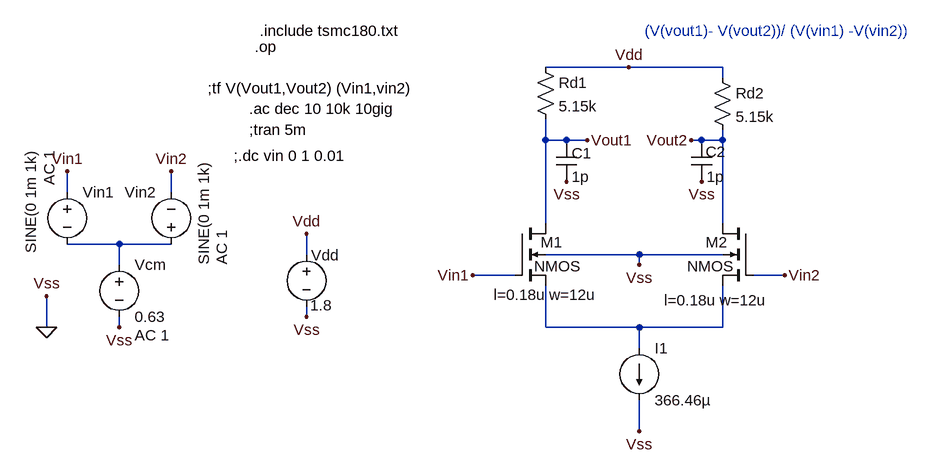
[diagram p0: schematic Differential pair.asc]
Differential pair.asc, the LTspice schematic file:
Version 4
SHEET 1 1248 680
WIRE 752 -64 624 -64
WIRE 896 -64 752 -64
WIRE 896 -48 896 -64
WIRE 624 48 624 16
WIRE 656 48 624 48
WIRE 688 48 656 48
WIRE 864 48 848 48
WIRE 896 48 896 32
WIRE 896 48 864 48
WIRE -112 128 -112 96
WIRE 48 128 48 96
WIRE 624 176 624 48
WIRE 896 176 896 48
WIRE -32 208 -112 208
WIRE 48 208 -32 208
WIRE 256 224 256 192
WIRE 768 224 624 224
WIRE 896 224 768 224
WIRE -32 240 -32 208
WIRE 768 240 768 224
WIRE 576 256 512 256
WIRE 992 256 944 256
WIRE 256 320 256 304
WIRE -144 336 -144 288
WIRE -32 336 -32 320
WIRE 624 336 624 272
WIRE 768 336 624 336
WIRE 896 336 896 272
WIRE 896 336 768 336
WIRE 768 368 768 336
WIRE 768 496 768 448
FLAG -144 336 0
FLAG -144 288 Vss
FLAG 256 320 Vss
FLAG -32 336 Vss
FLAG 256 192 Vdd
FLAG 512 256 Vin1
FLAG 752 -64 Vdd
FLAG 992 256 Vin2
FLAG 768 496 Vss
FLAG 688 48 Vout1
FLAG 848 48 Vout2
FLAG 768 240 Vss
FLAG -112 96 Vin1
FLAG 48 96 Vin2
FLAG 656 112 Vss
FLAG 864 112 Vss
SYMBOL nmos4 576 176 R0
WINDOW 0 40 29 Left 2
WINDOW 3 30 66 Left 2
WINDOW 123 127 110 Right 2
SYMATTR InstName M1
SYMATTR Value2 l=0.18u w=12u
SYMBOL voltage 256 208 R0
WINDOW 123 0 0 Left 0
WINDOW 39 0 0 Left 0
WINDOW 0 7 17 Left 2
WINDOW 3 6 94 Left 2
SYMATTR InstName Vdd
SYMATTR Value 1.8
SYMBOL res 608 -80 R0
SYMATTR InstName Rd1
SYMATTR Value 5.15k
SYMBOL nmos4 944 176 M0
WINDOW 0 40 29 Left 2
WINDOW 3 30 66 Left 2
WINDOW 123 -21 118 Left 2
SYMATTR InstName M2
SYMATTR Value2 l=0.18u w=12u
SYMBOL res 880 -64 R0
SYMATTR InstName Rd2
SYMATTR Value 5.15k
SYMBOL current 768 368 R0
WINDOW 123 0 0 Left 0
WINDOW 39 0 0 Left 0
SYMATTR InstName I1
SYMATTR Value 366.46µ
SYMBOL voltage -32 224 R0
WINDOW 123 24 124 Left 2
WINDOW 39 0 0 Left 0
SYMATTR InstName Vcm
SYMATTR Value 0.63
SYMATTR Value2 AC 1
SYMBOL voltage -112 112 R0
WINDOW 3 -56 -48 VRight 2
WINDOW 123 -28 -48 VRight 2
WINDOW 39 0 0 Left 0
SYMATTR InstName Vin1
SYMATTR Value SINE(0 1m 1k)
SYMATTR Value2 AC 1
SYMBOL voltage 48 224 R180
WINDOW 0 24 96 Left 2
WINDOW 3 -50 -16 VRight 2
WINDOW 123 -78 -16 VRight 2
WINDOW 39 0 0 Left 0
SYMATTR InstName Vin2
SYMATTR Value SINE(0 1m 1k)
SYMATTR Value2 AC 1
SYMBOL cap 640 48 R0
WINDOW 0 24 20 Left 2
SYMATTR InstName C1
SYMATTR Value 1p
SYMBOL cap 848 48 R0
WINDOW 0 22 18 Left 2
SYMATTR InstName C2
SYMATTR Value 1p
TEXT 184 -120 Left 2 !.include tsmc180.txt
TEXT 176 -96 Left 2 !.op
TEXT 104 -32 Left 2 !;tf V(Vout1,Vout2) (Vin1,vin2)
TEXT 168 0 Left 2 !.ac dec 10 10k 10gig
TEXT 168 32 Left 2 !;tran 5m
TEXT 144 72 Left 2 !;.dc vin 0 1 0.01
TEXT 776 -120 Left 2 ;(V(vout1)- V(vout2))/ (V(vin1) -V(vin2))

The netlist it stands for:
* Differential pair.asc
M1 Vout1 Vin1 N002 0 NMOS l=0.18u w=12u
Vdd Vdd 0 1.8
Rd1 Vdd Vout1 5.15k
M2 Vout2 Vin2 N002 0 NMOS l=0.18u w=12u
Rd2 Vdd Vout2 5.15k
I1 N002 0 366.46µ
Vcm N001 0 0.63 AC 1
Vin1 Vin1 N001 SINE(0 1m 1k) AC 1
Vin2 N001 Vin2 SINE(0 1m 1k) AC 1
C1 Vout1 0 1p
C2 Vout2 0 1p
.model NMOS NMOS
.model PMOS PMOS
.lib standard.mos
.include tsmc180.txt
.op
;tf V(Vout1,Vout2) (Vin1,vin2)
.ac dec 10 10k 10gig
;tran 5m
;.dc vin 0 1 0.01
* (V(vout1)- V(vout2))/ (V(vin1) -V(vin2))
.backanno
.end